# EAGLE schematic circuit (EAGLE 9.3.2)
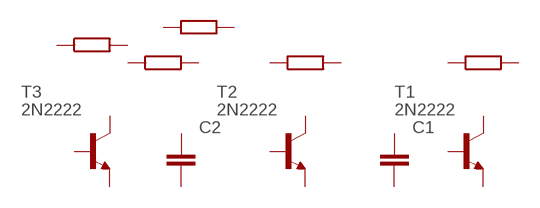
[diagram p0: schematic, sheet 1]

## Parts
C1  C  (no package)
C2  C  (no package)
T1  2N2222  [TO18]
T2  2N2222  [TO18]
T3  2N2222  [TO18]
Unconnected: C1.1 C1.2 C2.1 C2.2 T1.1(E) T1.2(B) T1.3(C) T2.1(E) T2.2(B) T2.3(C) T3.1(E) T3.2(B) T3.3(C)

## Library data of the parts
C1 C2 = ngspice-simulation:C: CAPACITOR
T1-T3 = transistor:2N2222: NPN TRANSISTOR